# Altium schematic sheet HVP_Amplifier_v1.0.SchDoc
size A3; Organization: SEW EURODRIVE; Address1: Jose Rubim Rd.; Address2: Santos Dumont Rd.; Address3: 205; Address4: Indaiatuba/SP; Address5: Brazil
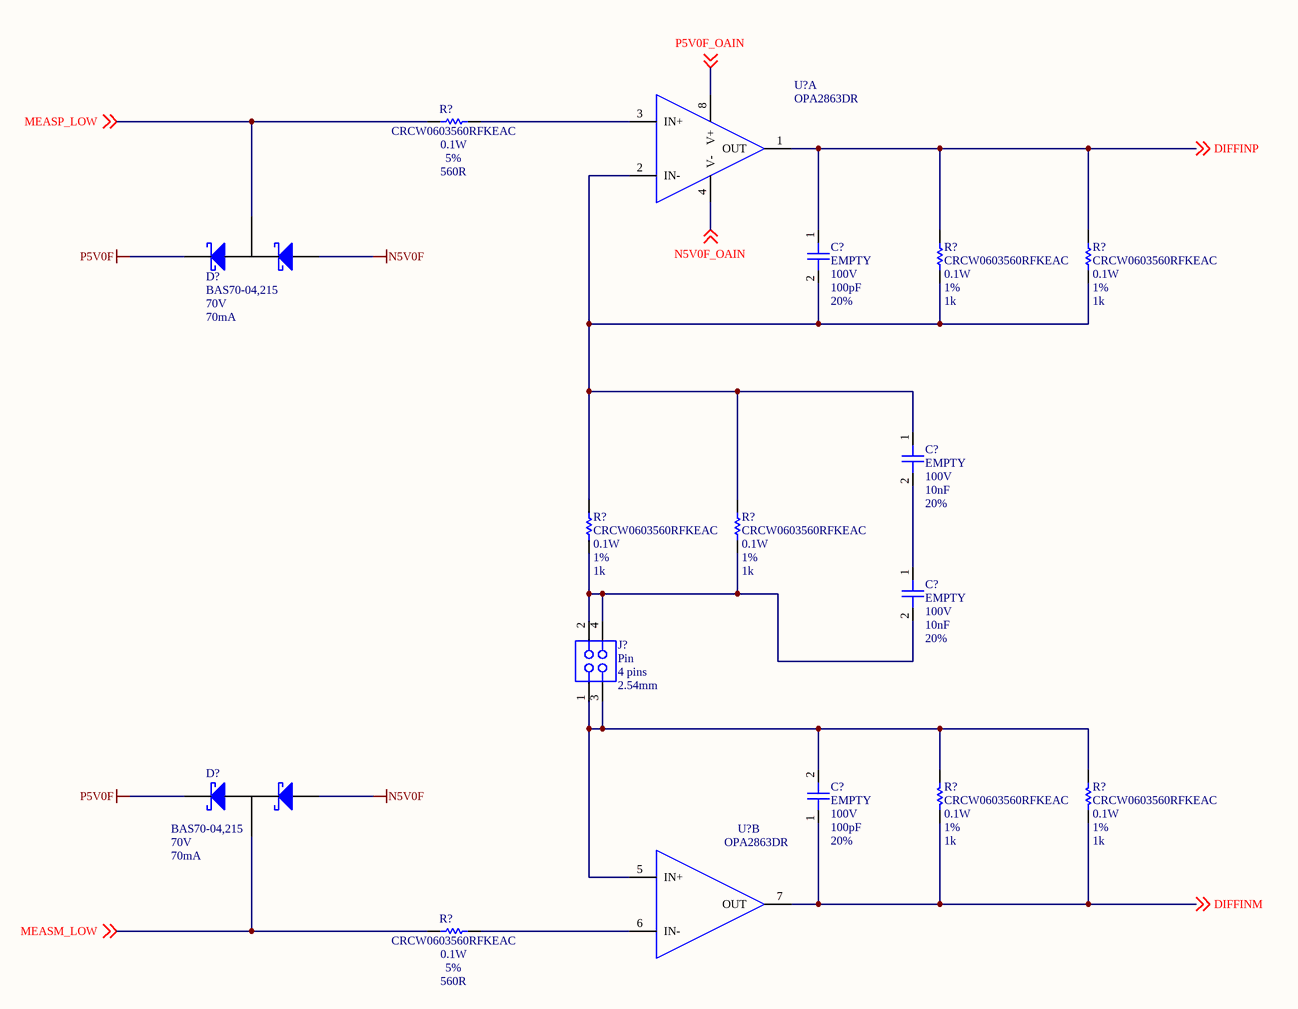
[diagram p0: HVP_Amplifier_v1.0.SchDoc]

## Parts
(Parts that share a designator on the sheet are numbered #1, #2 ... from top to bottom, then left to right.)
C?#1  value 100pF  PartNumber1: EMPTY  Voltage: 100V  Tolerance: 20%  [CAP0603]  (hidden comment: CC0603)
C?#2  value 10nF  PartNumber1: EMPTY  Voltage: 100V  Tolerance: 20%  [CAP0603]  (hidden comment: CC0603)
C?#3  value 10nF  PartNumber1: EMPTY  Voltage: 100V  Tolerance: 20%  [CAP0603]  (hidden comment: CC0603)
C?#4  value 100pF  PartNumber1: EMPTY  Voltage: 100V  Tolerance: 20%  [CAP0603]  (hidden comment: CC0603)
D?#1  Vrrm: 70V  If: 70mA  [SOT-23]  (hidden comment: BAS70-04,215)
D?#2  Vrrm: 70V  If: 70mA  [SOT-23]  (hidden comment: BAS70-04,215)
J?  Type: Pin  Pins: 4 pins  Pitch: 2.54mm  [CONDIL04STRMALE_100_100]  (hidden comment: 10-89-7042)
R?#1  value 560R  PartNumber1: CRCW0603560RFKEAC  Power: 0.1W  Tolerance: 5%  [RES0603]  (hidden comment: Chip Resistor)
R?#2  value 1k  PartNumber1: CRCW0603560RFKEAC  Power: 0.1W  Tolerance: 1%  [RES0603]  (hidden comment: Chip Resistor)
R?#3  value 1k  PartNumber1: CRCW0603560RFKEAC  Power: 0.1W  Tolerance: 1%  [RES0603]  (hidden comment: Chip Resistor)
R?#4  value 1k  PartNumber1: CRCW0603560RFKEAC  Power: 0.1W  Tolerance: 1%  [RES0603]  (hidden comment: Chip Resistor)
R?#5  value 1k  PartNumber1: CRCW0603560RFKEAC  Power: 0.1W  Tolerance: 1%  [RES0603]  (hidden comment: Chip Resistor)
R?#6  value 1k  PartNumber1: CRCW0603560RFKEAC  Power: 0.1W  Tolerance: 1%  [RES0603]  (hidden comment: Chip Resistor)
R?#7  value 1k  PartNumber1: CRCW0603560RFKEAC  Power: 0.1W  Tolerance: 1%  [RES0603]  (hidden comment: Chip Resistor)
R?#8  value 560R  PartNumber1: CRCW0603560RFKEAC  Power: 0.1W  Tolerance: 5%  [RES0603]  (hidden comment: Chip Resistor)
U?#1  OPA2863DR  [SOIC-8-3.9mm]  (part A of 2)
U?#2  OPA2863DR  [SOIC-8-3.9mm]  (part B of 2)

## Nets
N5V0F: D?#1.1(A1) D?#2.1(A1)
P5V0F: D?#1.2(K2) D?#2.2(K2)
DIFFINM: C?#4.1 R?#6.1 R?#7.1 U?#2.7(OUT) ; off-sheet DIFFINM
DIFFINP: C?#1.1 R?#2.1 R?#3.1 U?#1.1(OUT) ; off-sheet DIFFINP
MEASM_LOW: D?#2.3(K1A2) R?#8.2 ; off-sheet MEASM_LOW
MEASP_LOW: D?#1.3(K1A2) R?#1.2 ; off-sheet MEASP_LOW
N5V0F_OAIN: U?#1.4(V-) ; off-sheet N5V0F_OAIN
P5V0F_OAIN: U?#1.8(V+) ; off-sheet P5V0F_OAIN
NetC?#1_2: C?#1.2 C?#2.1 R?#2.2 R?#3.2 R?#4.1 R?#5.1 U?#1.2(IN-)
NetC?#2_2: C?#2.2 C?#3.1
NetC?#3_2: C?#3.2 J?.2 J?.4 R?#4.2 R?#5.2
NetC?#4_2: C?#4.2 J?.1 J?.3 R?#6.2 R?#7.2 U?#2.5(IN+)
NetR?#1_1: R?#1.1 U?#1.3(IN+)
NetR?#8_1: R?#8.1 U?#2.6(IN-)

## Notes on the sheet
- Title
- Author
- Checked By
- Size:
- Revision:
- A3
- Date:
- Project
- Time:
- Sheet
- of
- File:

## Library data of the parts
C?#1-C?#4 = CC0603: Surface Mount Multilayer Ceramic Chip Capacitors  for Commercial Applications; Manufacter1: Yageo; Published: 19-Jun-2016; LatestRevisionDate: 19-Jun-2016; Publisher: Lucas Moraes; PackageReference: CAP0603; PackageDescription: CAP0603;2 Leads
D?#1 D?#2 = BAS70-04,215: Schottky Diodes & Rectifiers 70V 225mW Single; Manufacter1: Nexperia; Vf: 0.475V; Published: 19-Agu-2019; LatestRevisionDate: 19-Agu-2019; PackageReference: SOT-23; Publisher: Lucas Moraes; PackageDescription: SOT-23 ; 2 Leads; PartNumber1: BAS70-04,215
J? = 10-89-7042: Headers & Wire Housings C-Grid PCB Conn SR V onn SR Vt Tn-A 4Ckt; Manufacter1: Molex; LastRevisionNote: Created; Gender: Male; Direction: 180; Published: 11-Sep-2017; LatestRevisionDate: 11-Sep-2017; PackageReference: CONDIL4; Publisher: Lucas Moraes; PackageDescription: CONDIL4; 4 Leads; PartNumber1: 10-89-7042
R?#1-R?#8 = CRCW0603: Thick Film Chip Resistors with CECC Approval,  available with Established Reliability; Manufacter1: Vishay; LatestRevisionDate: 06-May-2016; PackageReference: 0603; Publisher: Lucas Moraes; PackageDescription: SMD 0603; 2 Leads; Published: 06-May-2016
U?#1 U?#2 = OPA2863DR: High Speed Operational Amplifiers Dual, low-power, 110-MHz, 12-V, rail-to-rail input and output (RRIO) voltage-feedback amplifier; Manufacter1: Texas Instruments; Power: 200mW; Published: 18-Apr-2023; LatestRevisionDate: 18-Apr-2023; LatestRevisionNote: Created; PackageReference: SOIC8; Publisher: Lucas Moraes; PackageDescription: SOIC8; 8 Leads; Datasheet: https://www.ti.com/lit/ds/symlink/opa863.pdf; PartNumber1: OPA2863DR